# EAGLE design shinobi_environment (EAGLE 9.6.0)
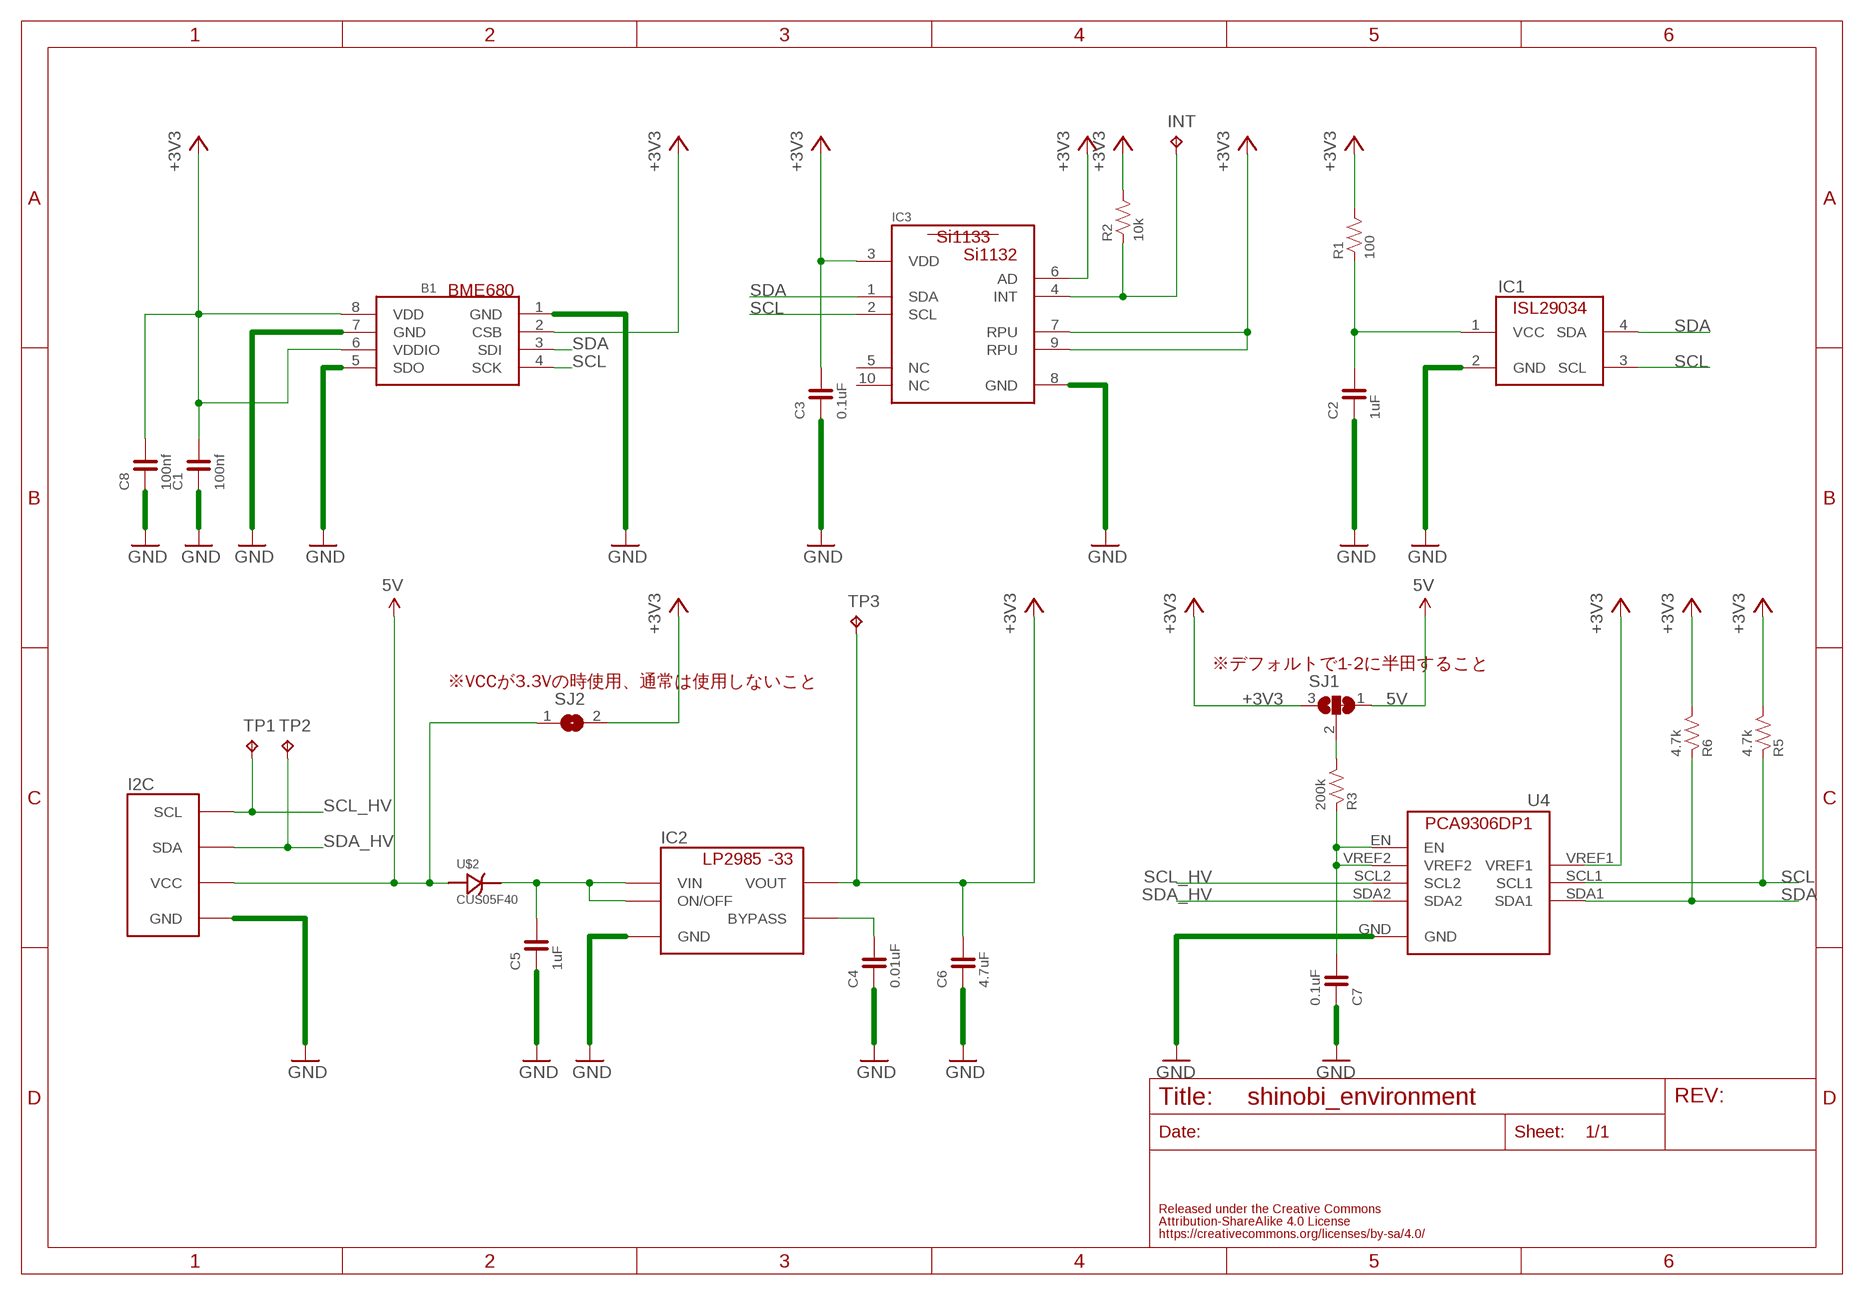
[diagram p0: schematic, sheet 1]

## Parts
B1  BO-BME680  [BOSCH-BME680]
C1  100nf  CAPACITOR-0603  [0603]
C2  1uF  CAPACITOR-0603  [0603]
C3  0.1uF  CAPACITOR-0603  [0603]
C4  0.01uF  CAPACITOR-0603  [0603]
C5  1uF  CAPACITOR-0603  [0603]
C6  4.7uF  CAPACITOR-0603  [0603]
C7  0.1uF  CAPACITOR-0603  [0603]
C8  100nf  CAPACITOR-0603  [0603]
I2C  FABO_BRICK_I2C-S04B-PASK-2_LONG  [FABO_BRICK_I2C_S04B-PASK-2_LONG]
IC1  IN-ISL29034  [INTERSIL-ISL29034]
IC2  LP2985-33DBV  [SOT-23-5]
IC3  SILICONLABS-SI1133  [SILICONLABS-SI1133]
INT  TPB1,27  [B1,27]
R1  100  RESISTOR-0603  [0603]
R2  10k  RESISTOR-0603  [0603]
R3  200k  RESISTOR-0603  [0603]
R5  4.7k  RESISTOR-0603  [0603]
R6  4.7k  RESISTOR-0603  [0603]
SJ1  SJ2W  [SJ_2]
SJ2  SJ  [SJ]
TP1  TPB1,27  [B1,27]
TP2  TPB1,27  [B1,27]
TP3  TPB1,27  [B1,27]
U4  PCA9306DP1  [TSSOP8]
U$2  CUS05F40  [CUS05F40]

## Nets
5V: I2C.VCC SJ1.1 SJ2.1 U$2.A(ANODE)
+3V3: B1.2(CSB) B1.6(VDDIO) B1.8(VDD) C1.2 C3.2 C6.2 C8.2 IC2.5(VOUT) IC3.3(VDD) IC3.6(AD) IC3.7(RPU) IC3.9(RPU) R1.2 R2.2 R5.2 R6.2 SJ1.3 SJ2.2 TP3.TP U4.VREF1
GND: B1.1(GND) B1.5(SDO) B1.7(GND) C1.1 C2.1 C3.1 C4.1 C5.1 C6.1 C7.1 C8.1 I2C.GND IC1.2(GND) IC2.2(GND) IC3.8(GND) U4.GND
N$2: C4.2 IC2.4(BYPASS)
N$3: C5.2 IC2.1(VIN) IC2.3(ON/OFF) U$2.C(CATHODE)
N$5: IC3.4(INT) INT.TP R2.1
N$8: C7.2 R3.1 U4.EN U4.VREF2
N$9: R3.2 SJ1.2
SCL: B1.4(SCK) IC1.3(SCL) IC3.2(SCL) R5.1 U4.SCL1
SCL_HV: I2C.SCL TP1.TP U4.SCL2
SDA: B1.3(SDI) IC1.4(SDA) IC3.1(SDA) R6.1 U4.SDA1
SDA_HV: I2C.SDA TP2.TP U4.SDA2
VCC: C2.2 IC1.1(VCC) R1.1
Unconnected: IC3.5(NC) IC3.10(NC)

## Notes on the sheet
- Si1132
- BME680
- ※デフォルトで1-2に半田すること
- ※VCCが3.3Vの時使用、通常は使用しないこと
- -33

## Library data of the parts
B1 = FaBo-Mems:BO-BME680
C1-C8 = FaBo-Capacitor:CAPACITOR: CAPACITOR
I2C = FaBo-Template:FABO_BRICK_I2C: FaBo Brick I2C
IC1 = FaBo-Mems:IN-ISL29034
IC2 = FaBo-Supply:LP2985: LP2985
IC3 = FaBo-Mems:SILICONLABS-SI1133
INT TP1-TP3 = testpad:TP: Test pad
R1-R3 R5 R6 = FaBo-Resistors:RESISTOR: RESISTOR
SJ1 = jumper:SJ2W: SMD solder JUMPER
SJ2 = jumper:SJ: SMD solder JUMPER
U4 = FaBo-LevelTranslator:PCA9306DP1
U$2 = FaBo-Diode:CUS05F40

## Board
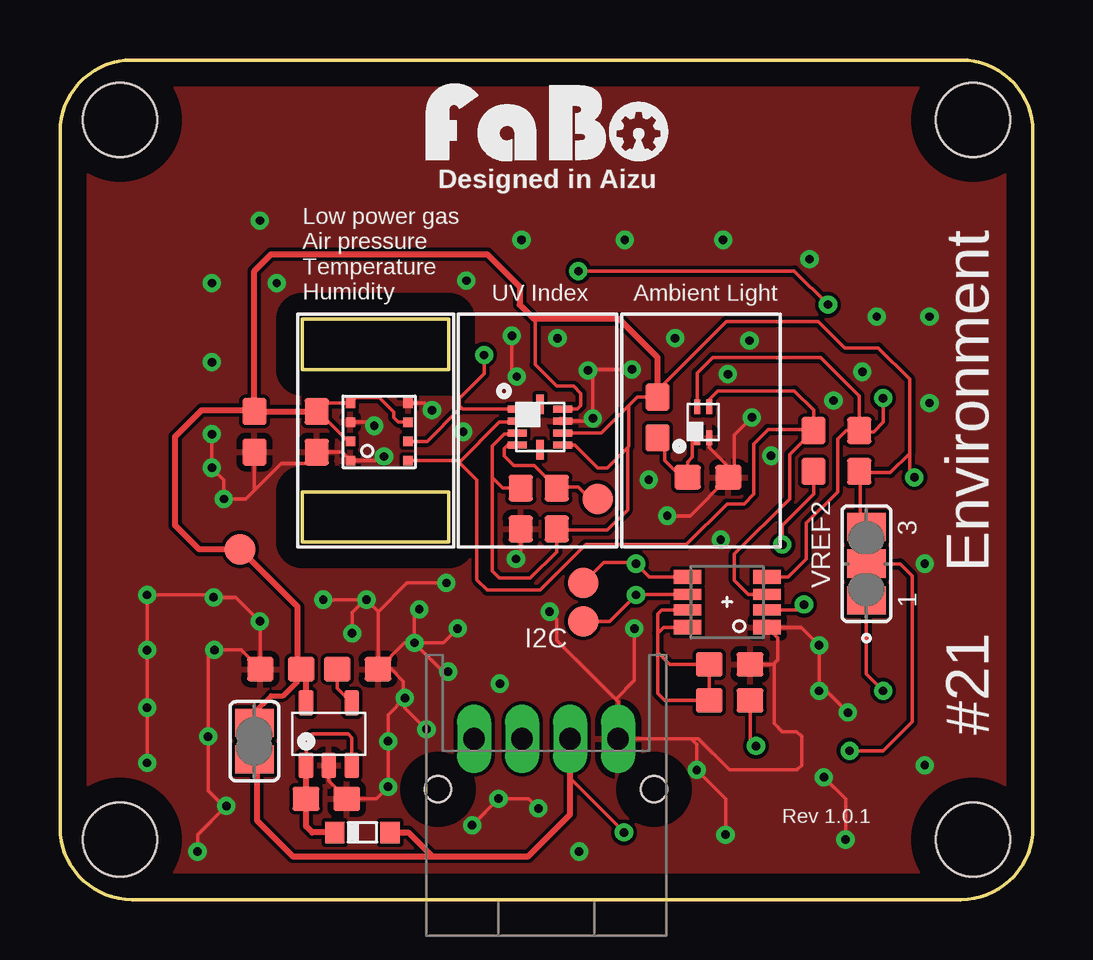
[diagram p1: board, top side]
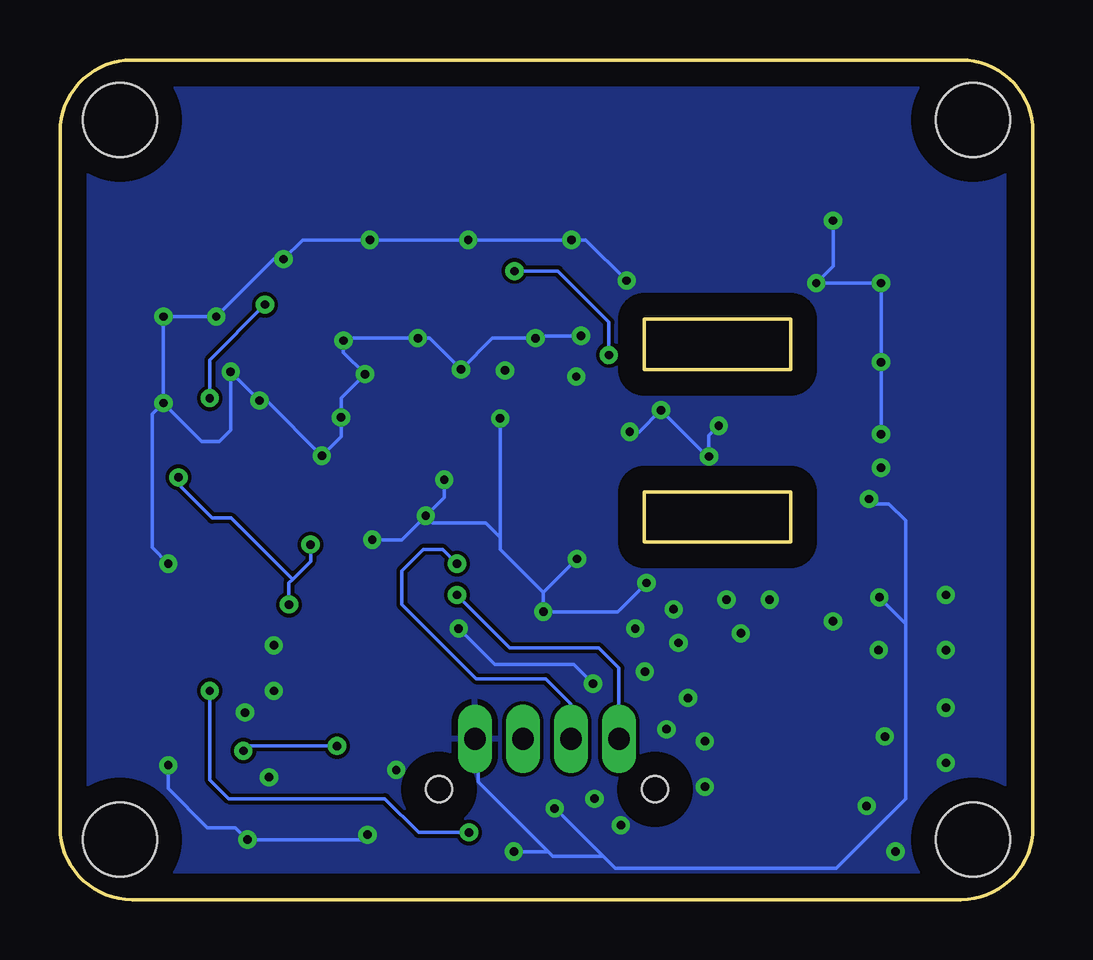
[diagram p2: board, bottom side, seen from below]

Size 40.54 x 35 mm. Coordinates in mm from the lower left corner, seen from the top.
Outline: 10.1,24.2 16.2,24.2 16.2,22.1 10.1,22.1 10.1,24.2
Outline: 10.1,17 16.2,17 16.2,14.9 10.1,14.9 10.1,17
Copper layers (1*16): Top 0.035mm / dielectric 1.5mm / Bottom 0.035mm
Design rules "default *": minimum track width 6mil, minimum drill 0.35mm, track to track 6mil, track to pad 6mil, pad to pad 6mil, via to via 6mil, smd to smd 6mil, copper to edge 40mil, drill to drill 6mil, minimum pad ring 10mil, minimum via ring 8mil, stop-mask expansion 4mil, vias tented up to drill 0.4mm, thermal gap 10mil

### Footprints (pad centres in the part's own frame; a part is rotated, then mirrored left to right if it is on the bottom)
BOSCH-BME680 = smd 0.4 x 0.4: 1 -1.2,1.2; 2 -0.4,1.2; 3 0.4,1.2; 4 1.2,1.2; 5 1.2,-1.2; 6 0.4,-1.2; 7 -0.4,-1.2; 8 -1.2,-1.2
0603 = smd 1.1 x 1: 1 -0.85,0; 2 0.85,0
FABO_BRICK_I2C_S04B-PASK-2_LONG = drill 0.9 pad 1.422 long: GND -3,0; SCL 3,0; SDA 1,0; VCC -1,0 | hole 1.1: 4.5,2.1; -4.5,2.1
INTERSIL-ISL29034 = smd 0.75 x 0.25: 1 -0.575,0.25 | smd 0.6 x 0.25: 2 -0.65,-0.25; 3 0.65,-0.25; 4 0.65,0.25
SOT-23-5 = smd 0.6 x 1.05: 1 -0.95,-1.3; 2 0,-1.3; 3 0.95,-1.3; 4 0.95,1.3; 5 -0.95,1.3
SILICONLABS-SI1133 = smd 0.8 x 0.3: 1 -0.95,0.75; 2 -0.95,0.25; 3 -0.95,-0.25; 4 -0.95,-0.75; 6 0.95,-0.75; 7 0.95,-0.25; 8 0.95,0.25; 9 0.95,0.75 | smd 0.3 x 0.8: 5 0,-0.95; 10 0,0.95
B1,27 = smd 1.27 x 1.27: TP 0,0
SJ_2 = smd 1.168 x 1.6: 1 -1.524,0; 2 0,0; 3 1.524,0
SJ = smd 1.168 x 1.6: 1 -0.762,0; 2 0.762,0
TSSOP8 = smd 0.6 x 1.15: EN -1.05,1.663; GND -1.05,-1.663; SDA1 1.05,-1.663; SDA2 1.05,1.663 | smd 0.45 x 1.15: SCL1 0.325,-1.663; SCL2 0.325,1.663; VREF1 -0.325,-1.663; VREF2 -0.325,1.663
CUS05F40 = smd 0.8 x 0.9: A -1.15,0; C 1.15,0
FABO-SHINOBI = hole 3.1: 2.5,32.5; 38.04,32.5; 38.04,2.5; 2.5,2.5

### Placement (x,y rotation side)
B1  13.3,19.5 270 top
C1  10.7,19.5 90 top
C2  27,17.6 180 top
C3  19.2,16.3 90 top
C4  12.4,9.6 180 top
C5  11.1,4.2 180 top
C6  9.2,9.6 0 top
C7  27.9,9.8 180 top
C8  8.1,19.5 90 top
I2C  20.25,6.7 180 top
IC1  26.8,19.9 90 top
IC2  11.2,6.9 0 top
IC3  20,19.7 0 top
INT  22.4,16.7 0 top
R1  24.9,20.1 90 top
R2  20.7,16.3 270 top
R3  27.9,8.3 0 top
R5  31.4,18.7 270 top
R6  33.3,18.7 270 top
SJ1  33.6,14 90 top
SJ2  8.1,6.6 90 top
TP1  21.8,11.6 0 top
TP2  21.8,13.2 0 top
TP3  7.5,14.6 0 top
U4  27.8,12.4 90 top
U$2  12.6,2.8 180 top
U$3  [FABO-SHINOBI]  0,0 0 top
U$14  [LOGO_FABO_MS]  20.3,30.4 0 top

### Tracks (layer width: path | path; a pad name or v marks a point on that pad's centre or on a via)
5V  (via drill 0.35)
  Top 0.152: SJ2.1 8.6,5.34 | SJ1.1 33.6,9.4 v34.3,8.7 | v23.5,2.8 21.25,5.05 I2C.VCC
  Top 0.254: 15.5,1.8 19.5,1.8 21.25,3.55 I2C.VCC | U$2.A 14.5,2.8 15.5,1.8 | SJ2.1 8.2,5.74 8.2,3.3 9.7,1.8 15.5,1.8
  Bottom 0.152: v34.3,8.7 34.3,5 33.5,4.2 27,4.2 25.6,2.8 v23.5,2.8
+3V3  (via drill 0.35)
  Top 0.152: IC3.3 19,19.37 18.97,19.4 18.5,19.4 18,18.9 18,17.6 | SJ2.2 8.44,7.7 | C3.2 18.45,17.15 18,17.6 | IC3.6 21.45,18.95 22.4,18 22.8,18 23.65,18.85 | 18,17.6 18,13.7 18.3,13.4 19.6,13.4 20.7,14.5 R2.2 20.75,15.4 22.07,15.4 22.8,15.4 23.65,16.25 23.65,18.85 | 23.7,20.6 23.7,18.9 23.65,18.85 | 23.7,20.6 24.05,20.95 R1.2 24.9,21.25 27.75,24.1 31.6,24.1 32.7,23 34.1,23 35.4,21.7 35.4,18.6 | B1.6 12,19.1 10.75,20.35 C1.2 11.05,20.7 B1.8 12.33,20.93 13.3,20.93 13.9,20.33 13.9,20.1 14.1,19.9 B1.2 | 35.4,18.6 34.6,17.8 33.35,17.8 | 33.35,17.8 R6.2 | R5.2 31.4,16.9 30.1,15.6 v30.1,14.8 | v31,12.3 30.77,12.07 U4.VREF1 | v35.6,17.6 35.4,17.8 35.4,18.6 | 8.1,20.4 C8.2 | IC3.9 21.55,20.45 21.7,20.6 21.7,21.1 21.4,21.4 20.7,21.4 19.8,22.3 19.8,24.15 19.75,24.2 | IC3.7 22.55,19.45 23.7,20.6 | C6.2 10.07,9.57 10.3,9.35 | SJ1.3 33.35,15.77 33.35,17.8
  Top 0.203: SJ2.2 8.1,7.8 8.8,8.5 9.3,8.5 9.93,9.12 9.93,9.72
  Top 0.254: 8.1,20.4 5.9,20.4 4.8,19.3 4.8,15.6 5.8,14.6 TP3.TP 9.9,12.2 9.9,9.75 9.93,9.72 C6.2 | C1.2 C8.2 8.1,26.2 8.8,26.9 17.8,26.9 19.15,25.55 19.15,24.8 19.75,24.2 23.3,24.2 24.9,22.6 R1.2 | IC2.5 10.25,9.4 10.07,9.57
  Bottom 0.152: v30.1,14.8 30.1,14.1 30.85,13.35 | 30.85,13.35 31,13.2 v31,12.3 | 30.85,13.35 33.4,15.9 34.2,15.9 35.6,17.3 v35.6,17.6
GND  (via drill 0.35)
  Top 0.152: IC2.2 11.2,4.95 C5.1 13.17,4.2 v13.67,4.7 v13.67,6.6 13.67,7.7 v14.37,8.4 | C7.1 29.7,9.8 29.75,9.85 | 29.75,9.85 29.9,10 29.9,10.91 U4.GND 30.88,11.35 v31.63,10.6 v31.63,8.7 31.93,8.7 v32.83,7.8 | IC1.2 27.05,18.85 27.85,18.05 C2.1 | B1.7 12.94,19.9 v13.09,19.75 | v13.5,18.47 13.33,18.3 B1.5 11.75,18.65 C1.1 10.22,18.17 9.22,18.17 8.1,17.05 | B1.1 15.2,20.7 v15.5,20.4 | C4.1 13.3,9.65 13.75,9.65 14.3,9.1 14.3,8.47 v14.37,8.4 | v20.4,12 20.7,11.7 20.7,10.8 23.15,8.35 | 23.15,8.35 23.25,8.25 I2C.GND 26.3,6.7 | C3.1 19.2,14.4 v19,14.2 | IC3.8 22.09,19.95 v22.2,20.06 22.2,21.86 v22,22.06 22.04,22.1 v23.83,22.1 | 8.1,17.05 7.75,16.7 v6.83,16.7 6.83,17.5 v6.33,18 v6.33,19.4 | 29.75,9.85 29.75,7.35 30.1,7 30.7,7 30.9,6.8 30.9,5.6 30.7,5.4 27.9,5.4 26.6,6.7 26.3,6.7 | C2.1 26.25,16 v25.3,16 | C8.1 8.1,17.05 | 26.3,6.7 26.53,6.47 v26.53,5.4 27.73,4.2 v27.73,2.7 | v23.93,11.3 23.93,9.13 23.15,8.35 | v31.83,5.1 32.73,4.2 v32.73,2.5 | C2.1 28.1,17.85 28.1,19.37 v28.83,20.1 | v19.03,21.8 18.83,22 v18.83,23.5 | C4.1 14.35,10.7 v14.77,10.7 | v14.77,10.7 15.97,9.5 v16.17,9.5 | v14.77,10.7 15.97,10.7 v16.57,11.3 | C4.1 13.25,12 | 13.25,12 13.25,12.02 v12.77,12.5 12.7,12.5 | 12.7,12.5 v10.97,12.5 | 13.25,12 14.45,13.2 v16.1,13.2 | v12.17,11.1 12.17,11.97 12.7,12.5 | v3.63,5.7 v3.63,8 v3.63,10.4 v3.63,12.7 6.3,12.7 v6.4,12.6 7.33,12.6 v8.33,11.6 8.35,11.58 C6.1 7.55,10.4 v6.43,10.4 6.17,10.14 v6.17,6.8 6.17,4.53 6.87,3.83 | v5.73,2 5.73,2.7 6.87,3.83 | 6.87,3.83 v6.93,3.9 | v15.27,7.1 14.37,8 v14.37,8.4 | v14.77,10.7 14.77,11.9 v14.97,12.1 | v17.17,3.1 v18.27,4.2 19.53,4.2 v19.93,3.8
  Bottom 0.152: v13.09,19.75 13.5,19.34 v13.5,18.47 13.57,18.47 v15.5,20.4 16.4,19.5 v16.8,19.5 | v16.1,13.2 17.3,12 v20.4,12 20.4,12.8 | v19,14.2 20.4,12.8 | v22.2,20.06 22.2,15.1 | 22.2,15.1 22.2,14.6 20.4,12.8 | v6.83,16.7 6.63,16.5 6,16.5 5.3,15.8 5.3,11.5 | 17.9,1.8 20,1.8 20.2,2 | 20.2,2 23.11,4.91 23.11,5.28 23.25,5.42 I2C.GND | 5.3,11.5 5.3,4.2 8.2,1.3 17.4,1.3 17.9,1.8 | v6.4,12.6 5.3,11.5 | v25.3,16 25,15.7 22.8,15.7 22.2,15.1 | v18.33,9 19.13,9.8 22.43,9.8 v23.93,11.3 | v16.93,25.8 18.63,27.5 v19.23,27.5 v23.53,27.5 v27.63,27.5 30.43,27.5 v31.23,26.7 31.63,26.7 v34.03,24.3 v36.23,24.3 v36.23,20.7 | v8.33,28.3 8.33,26.4 v9.03,25.7 v6.33,25.7 v6.33,22.4 v6.33,19.4 | v36.23,20.7 34.63,19.1 33.9,19.1 33.43,19.57 v33.43,22 v32.23,20.8 31.93,20.8 v29.63,18.5 28.83,19.3 v28.83,20.1 28.83,20.9 v27.83,21.9 28.73,22.8 v28.73,23.3 28.63,23.4 v25.63,23.4 25.13,23.4 v23.83,22.1 22.53,23.4 v20.73,23.4 20.63,23.5 v18.83,23.5 | v24.53,17.5 24.53,16.77 v25.3,16 | v25.3,16 26.3,15 v27.53,15 | v36.23,20.7 36.7,20.23 36.7,14.67 v36.03,14 | v36.03,5.6 36.03,4.63 34.4,3 33.23,3 v32.73,2.5 27.93,2.5 v27.73,2.7 | v21.63,2 20.2,2 | v19.93,3.8 19.9,3.8 17.9,1.8
  pour Top: 0,0 41,0 41,35 0,35
  pour Bottom: 0,0 41,0 41,35 0,35
N$2
  Top 0.152: IC2.4 11.55,8.8 C4.2
N$3
  Top 0.152: IC2.1 10.25,6.65 10.5,6.9 12,6.9 12.15,6.75 IC2.3
  Top 0.254: 11.4,2.8 U$2.C 10.5,2.8 10.25,3.05 C5.2 IC2.1
N$5
  Top 0.152: IC3.4 18.65,18.95 18.5,18.8 18.5,18.5 18.9,18.1 19.75,18.1 R2.1 20.75,17.2 21.6,17.2 22.1,16.7 INT.TP
N$8
  Top 0.152: U4.EN 25.15,11.35 24.9,11.1 | 24.9,11.1 24.9,10.3 | 24.9,10.3 25.4,9.8 C7.2 R3.1 25.2,8.3 24.9,8.6 24.9,10.3 | U4.VREF2 25.07,12.07 24.9,11.9 24.9,11.1
N$9  (via drill 0.35)
  Top 0.152: SJ1.2 35,14 35.5,13.5 35.5,7.4 34.3,6.2 v32.9,6.2 | R3.2 28.75,6.65 v29,6.4
  Bottom 0.152: v29,6.4 32.7,6.4 v32.9,6.2
SCL
  Top 0.152: U4.SCL1 28.68,12.72 28.1,13.3 28.1,14.4 30.4,16.7 30.4,18.55 R5.1 31.4,19.6 | IC3.2 19,19.9 18.3,19.9 16.63,18.23 | IC1.3 27.05,20.85 27.4,21.2 30.6,21.2 31.4,20.4 31.4,19.6 | 31.4,19.6 29.5,19.6 28.9,19 28.9,16.9 28.5,16.5 27.8,16.5 26.1,14.8 21.9,14.8 20,12.9 17.8,12.9 17.37,13.33 17.37,17.48 16.63,18.23 | 16.63,18.23 16.55,18.3 B1.4
SCL_HV  (via drill 0.35)
  Top 0.152: U4.SCL2 24.02,12.72 v24,12.7 22.9,11.6 TP1.TP
  Bottom 0.152: I2C.SCL 17.25,9.65 18.1,10.5 21.8,10.5 v24,12.7
SDA  (via drill 0.35)
  Top 0.152: R6.1 32.75,19.55 32.4,19.2 32.4,17 31.1,15.7 31.1,14.2 30.35,13.45 U4.SDA1 | R6.1 33.3,21 31.7,22.6 27.2,22.6 26.55,21.95 IC1.4 | B1.3 15.3,19.1 16.64,20.44 16.64,20.6 | 16.64,20.6 16.64,20.89 17.67,21.92 v17.67,22.7 | v34.3,20.9 34.3,19.9 33.9,19.5 33.35,19.5 R6.1 | v21.6,26.2 30.6,26.2 v32,24.8 | IC3.1 16.79,20.45 16.64,20.6
  Bottom 0.152: v32,24.8 34.3,22.5 v34.3,20.9 | v17.67,22.7 17.67,24.07 19.8,26.2 v21.6,26.2
SDA_HV  (via drill 0.35)
  Top 0.152: U4.SDA2 24.55,13.45 v24,14 23.95,14.05 22.65,14.05 TP2.TP
  Bottom 0.152: v24,14 24.6,14.6 25.4,14.6 26.3,13.7 26.3,12.3 23.2,9.2 20.3,9.2 19.25,8.15 I2C.SDA
VCC
  Top 0.152: C2.2 26.15,17.7 | 26.15,17.7 26.15,18.25 26.35,18.45 26.35,18.9 26.35,19.12 IC1.1 | R1.1 25.2,18.95 25.2,18.3 25.8,17.7 26.15,17.7

### Text on the board
tPlace: Designed in Aizu | Low power gas / Air pressure / Temperature / Humidity | UV Index | Ambient Light | Environment | 3 | VREF2 | 1 | #21 | Rev 1.0.1